# Altium schematic sheet Multivibrator.SchDoc: Наименование
size 209 x 297 mm; ApprovedBy: Утвердил; CheckedBy: Проверил; Author: Разработал; CompanyName: Организация; DrawnBy: Н.Контр; Engineer: Т.Контр; SheetNumber: 6; SheetTotal: 6; PageSetup: Record=PageOptions|CenterHorizontal=True|CenterVertical=True|PrintScale=0.94|XCorrection=1.00|YCorrection=1.00|PrintKind=1|BorderSize=5000000|LeftOffset=0|BottomOffset=0|Orientation=1|PaperLength=1000|PaperWidth=1000|Scale=100|PaperSource=7|PrintQuality=-4|MediaType=1|DitherType=10|PaperKind=A4|PrintScaleMode=1; DecimalNumber: Децимальный номер; HeadOfSector: Нач. сектора; MainDevice: Перв.примен.; Name: Наименование; DocumentName: Sheet1.SCHDOC
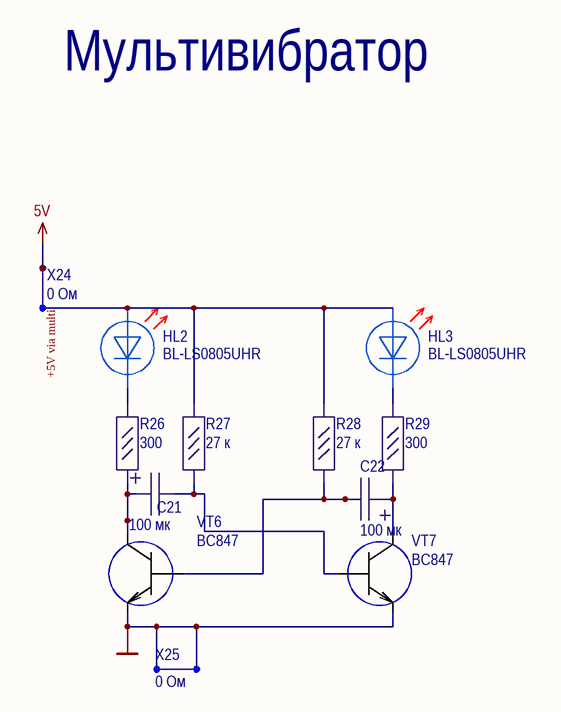
[diagram p0: Multivibrator.SchDoc]

## Parts
C21  100 мк  [SMD_al_cap_0605_6.3]
C22  100 мк  [SMD_al_cap_0605_6.3]
HL2  BL-LS0805UHR  [LED_0805_RED]
HL3  BL-LS0805UHR  [LED_0805_RED]
R26  300  [R_0805]
R27  27 к  [R_0805]
R28  27 к  [R_0805]
R29  300  [R_0805]
VT6  BC847  [SOT23]
VT7  BC847  [SOT23]
X24  0 Ом  [jumper]
X25  0 Ом  [jumper]

## Nets
5V: X24.2
GND: VT6.2(E) VT7.2(E) X25.1 X25.2
+5V via multi: HL2.1 HL3.1 R27.1 R28.1 X24.1
NetC21_1: C21.1 R26.2 VT6.3(C)
NetC21_2: C21.2 R27.2 VT7.1(B)
NetC22_1: C22.1 R29.2 VT7.3(C)
NetC22_2: C22.2 R28.2 VT6.1(B)
NetHL2_2: HL2.2 R26.1
NetHL3_2: HL3.2 R29.1

## Notes on the sheet
- Мультивибратор
- Подп. и дата
- Инв.№ дубл.
- Взам.инв.№
- Подп.и дата
- Инв.№ подл.
- Изм.
- Лист
- № докум.
- Подп.
- Дата
- Формат  A4

## Library data of the parts
C21 C22 = TAJB107K004RNJ: CAP TANT 100UF 10% 4V 1411; Manufacturer: AVX Corporation; Value: 100µF; Part Number: TAJB107K004RNJ; ComponentLink1URL: http://datasheets.avx.com/TAJ.pdf; ComponentLink1Description: Datasheet; Component Type: Tantalum Capacitor
R26-R29 = CR0603-FX-1002ELF: RES SMD 10K OHM 1% 1/10W 0603; Manufacturer: Bourns Inc.; Value: 10 к; Part Number: CR0603-FX-1002ELF; ComponentLink1URL: https://www.bourns.com/pdfs/chpreztr.pdf; ComponentLink1Description: Datasheet; Component Type: Resistor
X24 X25 = 0 Ohm (0805)